# EAGLE board KMO_IO_MV2_2 (EAGLE 9.4.0)
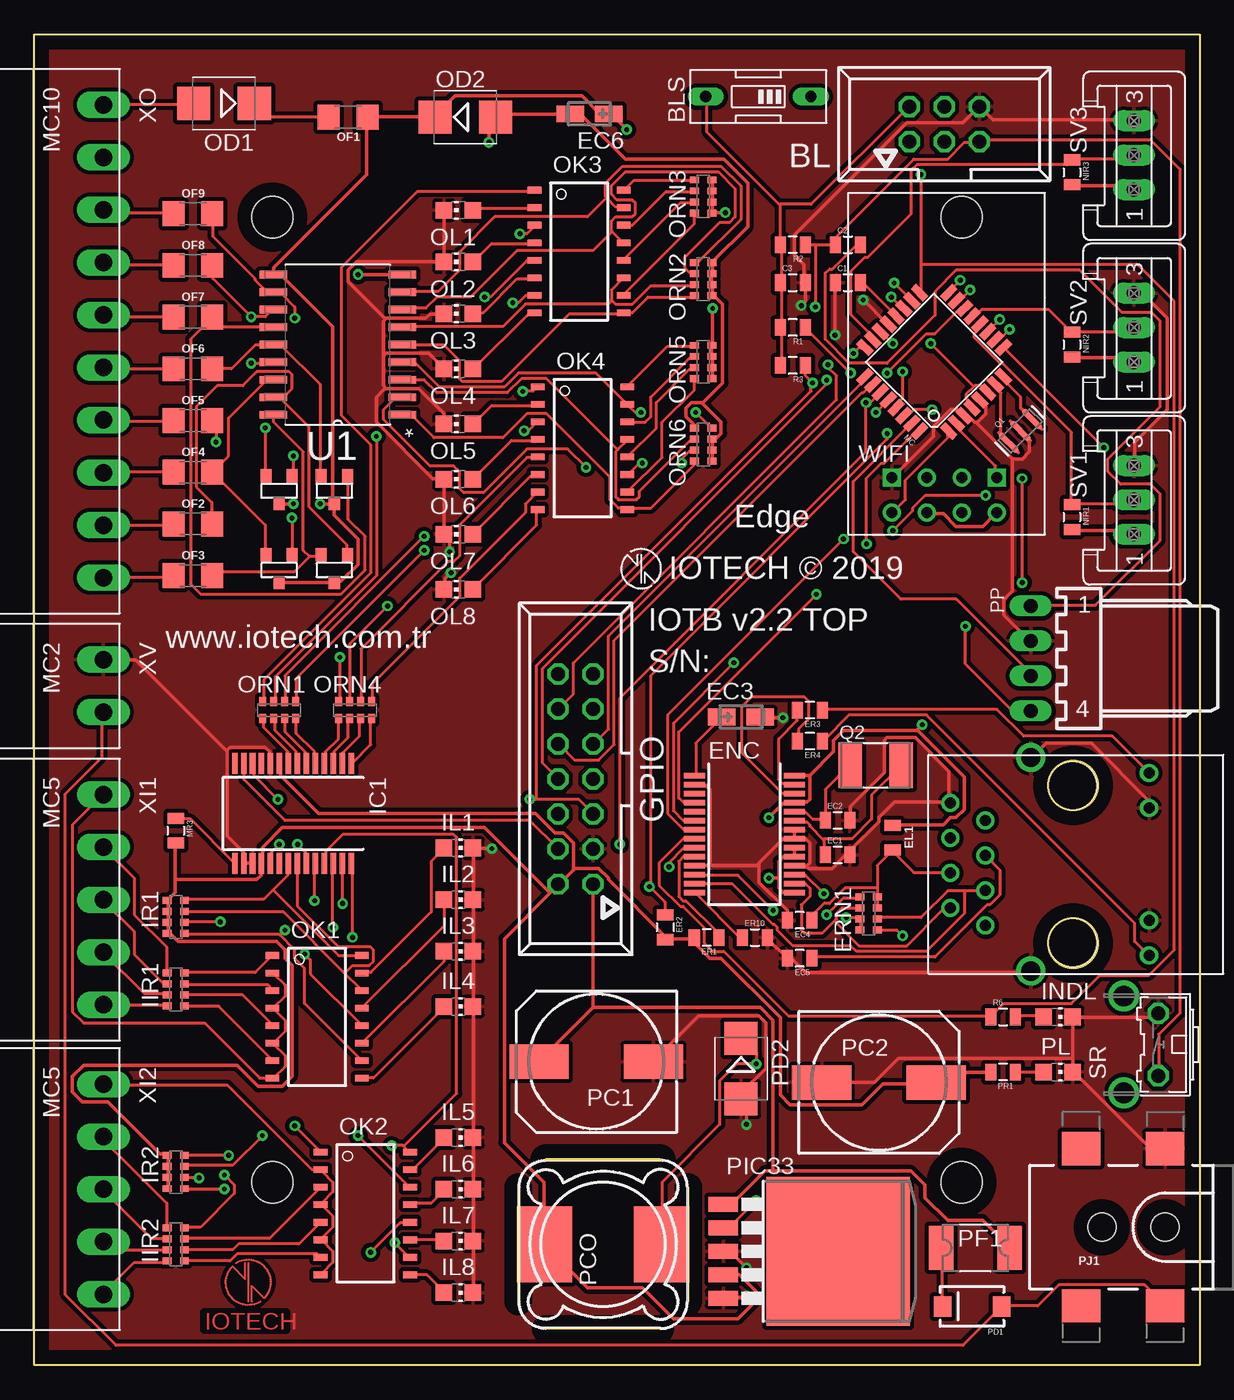
[diagram p2: board, top side]
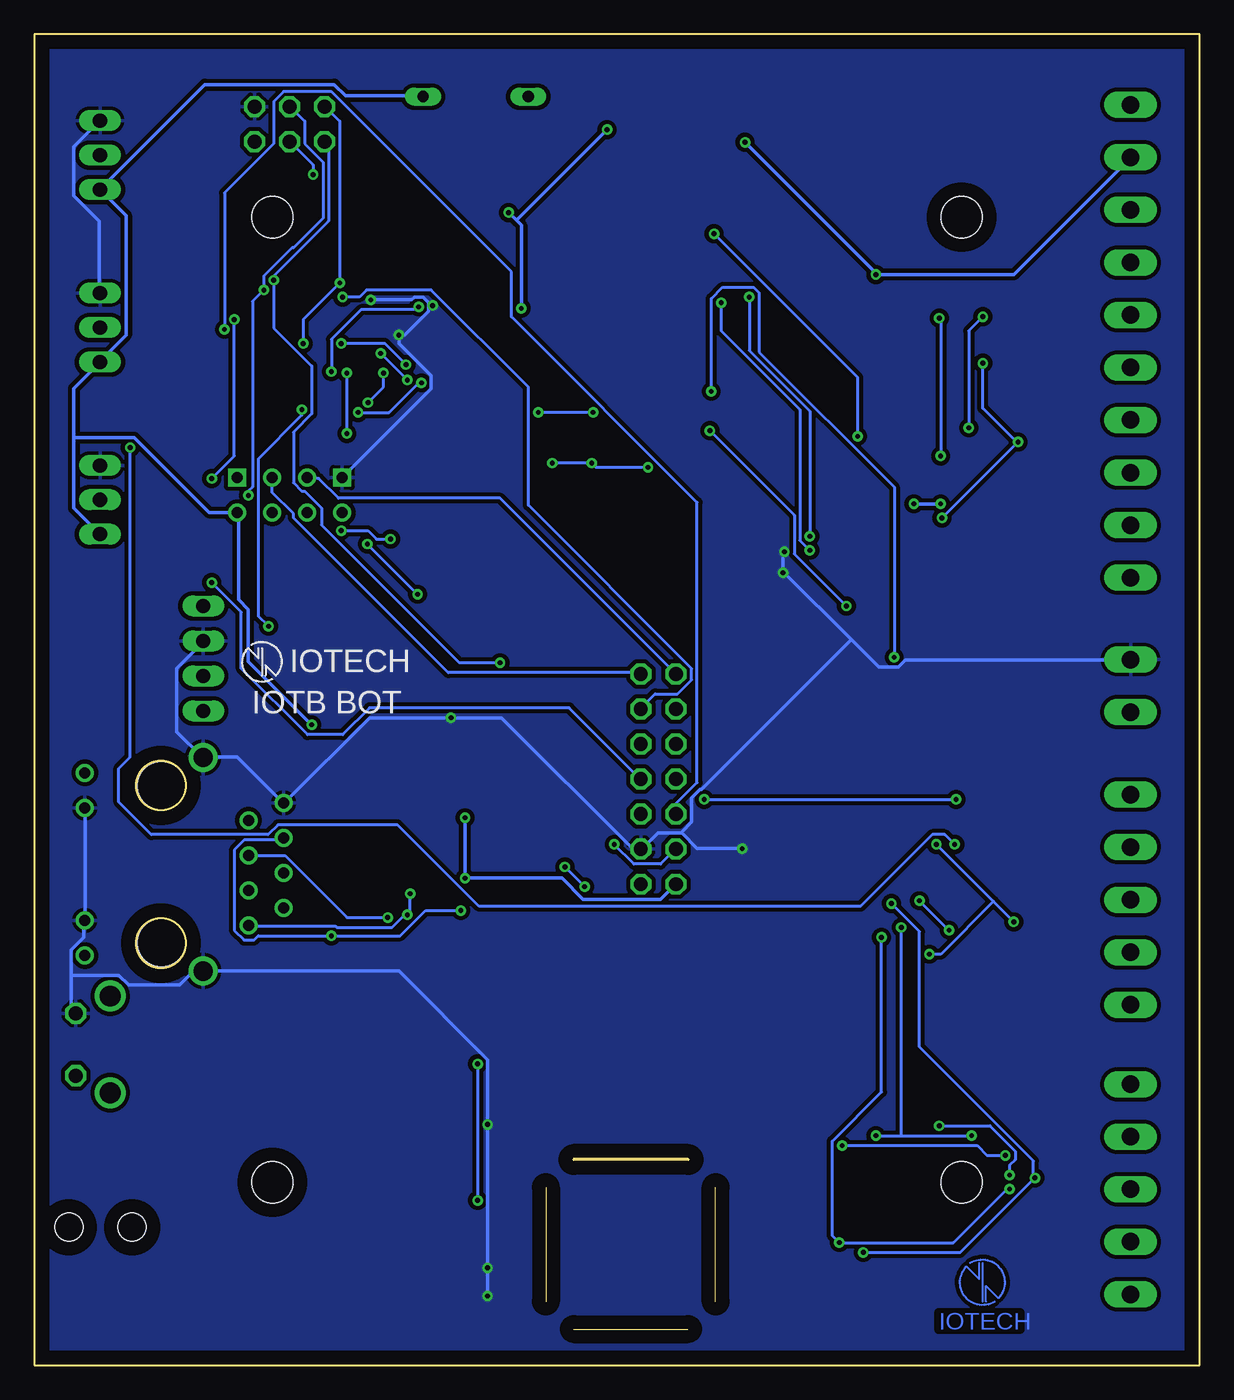
[diagram p3: board, bottom side, seen from below]

Size 84.5 x 96.5 mm. Coordinates in mm from the lower left corner, seen from the top.
Outline: 0,0 0,96.5 84.5,96.5 84.5,0 0,0
Copper layers (1*16): Top 0.035mm / dielectric 1.5mm / Bottom 0.035mm
Design rules "KMO_IO_M": minimum track width 6mil, minimum drill 0.35mm, track to track 0.205mm, track to pad 0.205mm, pad to pad 0.205mm, via to via 0.205mm, smd to smd 6mil, copper to edge 40mil, drill to drill 6mil, minimum pad ring 10mil, minimum via ring 8mil, stop-mask expansion 4mil, vias tented up to drill 0mil, thermal gap 10mil
Net classes: 0 default: width 0.203 mm, drill 0.3 mm, clearance 0.16 mm; 1 vcc: width 0.254 mm, drill 0.3 mm, clearance 0.16 mm; 2 3.3 power line: width 0.254 mm, drill 0.3 mm, clearance 0.16 mm; 3 outsise power line: width 0.254 mm, drill 0.3 mm, clearance 0.16 mm
Holes 3 mm at 17.25,83.25 67.25,83.25 17.25,13.25 67.25,13.25

## Footprints (pad centres in the part's own frame; a part is rotated, then mirrored left to right if it is on the bottom)
057-006-1 = drill 1 octagon: 1 -2.54,-1.27; 2 -2.54,1.27; 3 0,-1.27; 4 0,1.27; 5 2.54,-1.27; 6 2.54,1.27
EDG-01 = drill 0.813 long: 1 0,-3.81; 2 0,3.81
0805 = smd 0.8 x 1.2: 1 -0.9,0; 2 0.9,0
SOT-23-3 = smd 0.802 x 0.972: 1 -0.95,-1; 2 0.95,-1; 3 0,1
CT3216 = smd 2 x 1.2: + -1.4,0; - 1.4,0
SSOP28 = smd 0.4 x 1.5: 1 -4.225,-3.625; 2 -3.575,-3.625; 3 -2.925,-3.625; 4 -2.275,-3.625; 5 -1.625,-3.625; 6 -0.975,-3.625; 7 -0.325,-3.625; 8 0.325,-3.625; 9 0.975,-3.625; 10 1.625,-3.625; 11 2.275,-3.625; 12 2.925,-3.625; 13 3.575,-3.625; 14 4.225,-3.625; 15 4.225,3.625; 16 3.575,3.625; 17 2.925,3.625; 18 2.275,3.625; 19 1.625,3.625; 20 0.975,3.625; 21 0.325,3.625; 22 -0.325,3.625; 23 -0.975,3.625; 24 -1.625,3.625; 25 -2.275,3.625; 26 -2.925,3.625; 27 -3.575,3.625; 28 -4.225,3.625
0603-ARV = smd 0.5 x 0.65: 1 -1.2,-0.625; 2 -0.4,-0.625; 3 0.4,-0.625; 4 1.2,-0.625; 5 1.2,0.625; 6 0.4,0.625; 7 -0.4,0.625; 8 -1.2,0.625
057-014-1 = drill 1 octagon: 1 -7.62,-1.27; 2 -7.62,1.27; 3 -5.08,-1.27; 4 -5.08,1.27; 5 -2.54,-1.27; 6 -2.54,1.27; 7 0,-1.27; 8 0,1.27; 9 2.54,-1.27; 10 2.54,1.27; 11 5.08,-1.27; 12 5.08,1.27; 13 7.62,-1.27; 14 7.62,1.27
CHIP-LED0805 = smd 1.2 x 1.2: A 0,-1.05; C 0,1.05
TQFP32-08 = smd 1.27 x 0.559: 1 -4.293,2.8; 2 -4.293,2; 3 -4.293,1.2; 4 -4.293,0.4; 5 -4.293,-0.4; 6 -4.293,-1.2; 7 -4.293,-2; 8 -4.293,-2.8; 17 4.293,-2.8; 18 4.293,-2; 19 4.293,-1.2; 20 4.293,-0.4; 21 4.293,0.4; 22 4.293,1.2; 23 4.293,2; 24 4.293,2.8 | smd 0.559 x 1.27: 9 -2.8,-4.293; 10 -2,-4.293; 11 -1.2,-4.293; 12 -0.4,-4.293; 13 0.4,-4.293; 14 1.2,-4.293; 15 2,-4.293; 16 2.8,-4.293; 25 2.8,4.293; 26 2,4.293; 27 1.2,4.293; 28 0.4,4.293; 29 -0.4,4.293; 30 -1.2,4.293; 31 -2,4.293; 32 -2.8,4.293
SMB = smd 2.4 x 2.4: A 2.2,0; C -2.2,0
1206 = smd 1.6 x 1.8: 1 -1.4,0; 2 1.4,0
MINI-FLAT-16 = smd 1 x 0.5: 1 -3.24,4.445; 2 -3.24,3.175; 3 -3.24,1.905; 4 -3.24,0.635; 5 -3.24,-0.635; 6 -3.24,-1.905; 7 -3.24,-3.175; 8 -3.24,-4.445; 9 3.24,-4.445; 10 3.24,-3.175; 11 3.24,-1.905; 12 3.24,-0.635; 13 3.24,0.635; 14 3.24,1.905; 15 3.24,3.175; 16 3.24,4.445
140CLH-1010 = smd 4.3 x 2.5: + 4.15,0; - -4.15,0
MSS1260 = smd 5.5 x 4: P$1 0,4.25; P$2 0,-4.25
SMA-DIODE = smd 1.27 x 1.47: A -2.15,0; C 2.15,0
1820 = smd 1.78 x 3.2: 1 -2.49,0; 2 2.49,0
TO263-5 = smd 1.067 x 2.159: 1 -3.404,-5.791; 2 -1.702,-5.791; 3 0,-5.791; 4 1.702,-5.791; 5 3.404,-5.791 | smd 10.8 x 10.41: 6 0,2.54
POWER_JACK_SMD_OVERPASTE_TOE = smd 2.8 x 2.4: GND 0,-5.7; P$4 6.1,-5.7; VIN0 0,5.7; VIN1 6.1,5.7 | hole 2.032: 0,0; 4.572,0
7395-04 = drill 1.016 long: 1 3.81,0; 2 1.27,0; 3 -1.27,0; 4 -3.81,0
RESONATOR-SMD-1:1 = smd 0.45 x 1.905: 1 -1.2,0; 2 0,0; 3 1.2,0
5.0X3.2_2 = smd 1.7 x 3.3: 1 -1.85,0; 2 1.85,0
B3F-31XX = drill 1.016 octagon: 1 -2.261,-1.245; 2 2.261,-1.245 | drill 1.499 pad 2.159: 3 -3.505,1.245; 4 3.505,1.245
S03P = drill 1.016 long: 1 2.5,0; 2 0,0; 3 -2.5,0
SOIC127P1030X265-18N = smd 1.981 x 0.559: 1 -4.674,5.08; 2 -4.674,3.81; 3 -4.674,2.54; 4 -4.674,1.27; 5 -4.674,0; 6 -4.674,-1.27; 7 -4.674,-2.54; 8 -4.674,-3.81; 9 -4.674,-5.08; 10 4.674,-5.08; 11 4.674,-3.81; 12 4.674,-2.54; 13 4.674,-1.27; 14 4.674,0; 15 4.674,1.27; 16 4.674,2.54; 17 4.674,3.81; 18 4.674,5.08
RJ45 = drill 0.8: G+ 5.84,-6.305; G- 5.84,-3.765; GND -8.57,4.76; NC -6.03,3.5; P4 -8.57,-0.32; P5 -6.03,0.96; RD+ -6.03,-1.58; RD- -8.57,2.22; TD+ -6.03,-4.12; TD- -8.57,-2.86; Y+ 5.84,6.945; Y- 5.84,4.405 | drill 1.4: SHIELD1 -2.73,-7.425; SHIELD2 -2.73,8.065 | hole 3.5: 0.3,-5.38; 0.3,6.02
ESP01 = drill 0.8: CH_PD -1.285,-8.178; GPIO0 1.255,-5.638; GPIO2 -1.285,-5.638; RST 1.255,-8.178; TX -3.825,-8.178; VCC 3.795,-8.178 | drill 0.8 square: GND -3.825,-5.638; RX 3.795,-5.638
MC5 = drill 1.27 long: 1 -7.62,0; 2 -3.81,0; 3 0,0; 4 3.81,0; 5 7.62,0
MC10 = drill 1.27 long: 1 -17.145,0; 2 -13.335,0; 3 -9.525,0; 4 -5.715,0; 5 -1.905,0; 6 1.905,0; 7 5.715,0; 8 9.525,0; 9 13.335,0; 10 17.145,0
MC2 = drill 1.27 long: 1 -1.905,0; 2 1.905,0

## Placement (x,y rotation side)
BL  057-006-1  [057-006-1]  66,90 0 top
BLS  on-off  [EDG-01]  52.5,92 90 top
C1  100nF  [0805]  59,78.5 0 top
C2  100nF  [0805]  59,81.25 0 top
C3  100nF  [0805]  55,78.5 0 top
D1  BAV70  [SOT-23-3]  21.75,57.75 180 top
D2  BAV70  [SOT-23-3]  17.75,57.75 180 top
D3  BAV70  [SOT-23-3]  21.75,63.5 180 top
D4  BAV70  [SOT-23-3]  17.75,63.5 180 top
EC1  18p  [0805]  58.25,37 0 top
EC2  18p  [0805]  58.25,39.5 0 top
EC3  10u  [CT3216]  51.25,47 0 top
EC4  10n  [0805]  55.5,32.25 180 top
EC5  10n  [0805]  55.5,29.5 180 top
EC6  10u  [CT3216]  40.25,90.75 180 top
EL1  10µH  [0805]  62.25,38.25 270 top
ENC  ENC28J60-SSOP  [SSOP28]  51.5,38.5 270 top
ER1  10k  [0805]  48.75,31 180 top
ER2  10k  [0805]  45.75,31.75 270 top
ER3  1k  [0805]  56.25,47.5 180 top
ER4  1k  [0805]  56.25,45.25 180 top
ER10  2.7K  [0805]  52.25,31 0 top
ERN1  49.9R  [0603-ARV]  60.5,32.75 270 top
GPIO  057-014-1  [057-014-1]  39.25,42.5 90 top
IC1  MCP23017SS  [SSOP28]  18.75,40 180 top
IIR1  6.8K  [0603-ARV]  10.25,27.25 270 top
IIR2  6.8K  [0603-ARV]  10.25,8.75 270 top
IL1  BLU  [CHIP-LED0805]  30.75,37.5 270 top
IL2  BLU  [CHIP-LED0805]  30.75,33.75 270 top
IL3  BLU  [CHIP-LED0805]  30.75,30 270 top
IL4  BLU  [CHIP-LED0805]  30.75,26 270 top
IL5  BLU  [CHIP-LED0805]  30.75,16.5 270 top
IL6  BLU  [CHIP-LED0805]  30.75,12.75 270 top
IL7  BLU  [CHIP-LED0805]  30.75,9 270 top
IL8  BLU  [CHIP-LED0805]  30.75,5.25 270 top
INDL  BLU  [CHIP-LED0805]  74.25,25.25 270 top
IR1  1K  [0603-ARV]  10.25,32.5 270 top
IR2  1K  [0603-ARV]  10.25,14 270 top
MC  ATMEGA328  [TQFP32-08]  65.25,72.75 135 top
MR3  10K  [0805]  10.25,38.75 270 top
NIR1  4700  [0805]  75.25,61.5 270 top
NIR2  4700  [0805]  75.25,74 270 top
NIR3  4700  [0805]  75.25,86.5 270 top
OD1  SS54  [SMB]  13.75,91.5 180 top
OD2  28V  [SMB]  31.25,90.5 0 top
OF1  750mA  [1206]  22.75,90.5 180 top
OF2  100mA  [1206]  11.5,61 0 top
OF3  100mA  [1206]  11.5,57.25 0 top
OF4  100mA  [1206]  11.5,64.75 0 top
OF5  100mA  [1206]  11.5,68.5 0 top
OF6  100mA  [1206]  11.5,72.25 0 top
OF7  100mA  [1206]  11.5,76 0 top
OF8  100mA  [1206]  11.5,79.75 0 top
OF9  100mA  [1206]  11.5,83.5 0 top
OK1  TLP283-4  [MINI-FLAT-16]  20.5,25.25 0 top
OK2  TLP283-4  [MINI-FLAT-16]  24,11 0 top
OK3  TLP283-4  [MINI-FLAT-16]  39.5,80.75 0 top
OK4  TLP283-4  [MINI-FLAT-16]  39.75,66.5 0 top
OL1  BLU  [CHIP-LED0805]  30.75,83.75 90 top
OL2  BLU  [CHIP-LED0805]  30.75,80 90 top
OL3  BLU  [CHIP-LED0805]  30.75,76.25 90 top
OL4  BLU  [CHIP-LED0805]  30.75,72.25 90 top
OL5  BLU  [CHIP-LED0805]  30.75,68.25 90 top
OL6  BLU  [CHIP-LED0805]  30.75,64.25 90 top
OL7  BLU  [CHIP-LED0805]  30.75,60.25 90 top
OL8  BLU  [CHIP-LED0805]  30.75,56.25 90 top
ORN1  1K  [0603-ARV]  17.75,47.5 180 top
ORN2  10K  [0603-ARV]  48.5,78.75 270 top
ORN3  10K  [0603-ARV]  48.5,84.75 270 top
ORN4  1K  [0603-ARV]  23.25,47.5 180 top
ORN5  10K  [0603-ARV]  48.5,72.75 270 top
ORN6  10K  [0603-ARV]  48.5,66.75 270 top
PC1  220uf 50v  [140CLH-1010]  40.75,22 180 top
PC2  220uf 50v  [140CLH-1010]  61.25,20.5 0 top
PCO  220 uh  [MSS1260]  41.25,8.75 90 top
PD1  M7  [SMA-DIODE]  68,4.25 180 top
PD2  SS54  [SMB]  51.25,21.5 270 top
PF1  1A  [1820]  68.25,8.5 0 top
PIC33  LM2596S  [TO263-5]  55.75,8.25 270 top
PJ1  POWER_JACKTOE  [POWER_JACK_SMD_OVERPASTE_TOE]  82,10 180 top
PL  GRN  [CHIP-LED0805]  74.25,21.25 270 top
PP  22-05-7048-04  [7395-04]  72.25,51.25 90 top
PR1  1k  [0805]  70.25,21.25 180 top
Q1  8MHz  [RESONATOR-SMD-1:1]  71.5,67.75 45 top
Q2  25MHz  [5.0X3.2_2]  61,43.5 0 top
R1  1.5K  [0805]  55,75.25 180 top
R2  10K  [0805]  55,81.25 180 top
R3  1.5K  [0805]  55,72.5 180 top
R6  1k  [0805]  70.25,25.25 0 top
SR  gnd  [B3F-31XX]  80.25,23.25 90 top
SV1  3.3V  [S03P]  79.75,62.75 270 top
SV2  3.3V  [S03P]  79.75,75.25 270 top
SV3  3.3V  [S03P]  79.75,87.75 270 top
U1  ULN2803ADW  [SOIC127P1030X265-18N]  22,74 180 top
U$1  [IOTECH_COPPER_W_TEXT]  15.5,6 0 top
U$2  HR911105A  [RJ45]  75,36 0 top
U$4  [IOTECH_COPPER_W_TEXT]  15.75,6 0 bottom
WIFI  ESP01  [ESP01]  66,70 0 top
XI1  MC5  [MC5]  5,33.75 270 top
XI2  MC5  [MC5]  5,12.75 270 top
XO  MC10  [MC10]  5,74.25 270 top
XV  MC2  [MC2]  5,49.25 270 top

## Tracks (layer width: path | path; a pad name or v marks a point on that pad's centre or on a via)
+3V3  (via drill 0.35)
  Top 0.254: WIFI.CH_PD 64.8,61.74 65.92,61.74 66.84,60.82 68.78,60.82 69.7,61.74 WIFI.VCC | NIR1.2 75.31,60.52 79.5,60.52 79.7,60.31 SV1.1 | NIR2.2 75.31,73.07 79.39,73.07 79.7,72.76 SV2.1 | NIR3.2 75.31,85.52 79.5,85.52 79.7,85.31 SV3.1 | IR2.4 9.7,12.86 9.7,13.57 IR2.3 9.7,13.68 9.7,14.29 IR2.2 9.7,14.49 9.7,15.1 IR2.1 9.59,15.31 9.08,15.31 5.31,19.08 3.47,19.08 2.75,19.8 2.75,20.92 3.57,21.74 14.7,21.74 16.23,20.21 17.96,20.21 18.68,20.92 18.68,28.98 18.16,29.49 18.16,30.11 17.55,30.72 10.41,30.72 9.8,31.33 IR1.4 9.7,31.33 9.7,32.04 IR1.3 9.7,32.15 9.7,32.86 IR1.2 9.7,32.96 9.7,33.68 IR1.1 9.7,33.78 10.21,34.29 10.21,35.21 | 10.21,35.21 10.21,37.76 MR3.2 | 10.21,35.21 16.12,35.21 16.43,35.51 16.43,36.33 IC1.18 16.53,36.43 16.53,37.55 17.96,38.98 32.66,38.98 37.4,34.24 | PIC33.4 50.01,6.53 51.13,6.53 52.35,5.31 52.35,4.69 51.02,3.37 46.33,3.37 44.09,5.61 40.11,5.61 37.04,8.67 PCO.P$1 36.94,8.78 36.94,13.27 34.09,16.12 34.09,30.92 37.4,34.24 | 64.09,46.02 67.45,42.66 67.45,40.31 66.84,39.7 66.44,39.7 65.92,39.19 62.25,39.19 EL1.1 | 64.09,46.02 58.68,46.02 57.96,45.31 57.96,44.49 56.23,42.76 | 56.23,42.76 55.21,42.76 ENC.28 | 56.23,42.76 56.23,41.02 56.02,40.82 55.21,40.82 ENC.25 55.11,40.72 54.29,40.72 v53.27,39.7 | PR1.2 69.29,21.23 66.13,21.23 65.41,20.51 PC2.+ 65.31,20.41 61.54,20.41 60.01,18.88 54.8,18.88 54.09,19.59 54.09,25.21 49.8,29.49 48.98,29.49 47.66,30.82 ER1.2 47.76,30.92 45.82,30.92 ER2.2 45.82,31.02 41.64,35.21 41.64,35.31 40.92,36.02 39.09,36.02 | 53.98,35.31 53.98,36.53 54.29,36.84 55.11,36.84 ENC.19 55.11,36.94 55.11,37.45 ENC.20
  Top 0.254: 53.98,35.31 53.98,34.59 54.29,34.29 55.11,34.29 ENC.15 | 39.09,36.02 39.09,35.92 38.06,34.9 GPIO.2 37.96,34.8 37.4,34.24 | 39.09,36.02 39.09,37.86 38.37,38.58 37.76,38.58 36.33,40 20.61,40 17.86,42.76 17.86,43.58 IC1.9 | v53.27,35.31 53.98,35.31 | v64.39,46.43 64.09,46.13 64.09,46.02
  Bottom 0.254: 81.64,67.25 81.64,70.82 79.8,72.66 SV2.1 79.7,72.86 77.86,74.7 77.86,83.38 79.7,85.21 SV3.1 79.7,85.31 72.15,92.86 62.76,92.86 61.94,92.05 56.33,92.05 BLS.1 | 81.64,67.25 81.64,62.15 79.8,60.31 SV1.1 | 81.64,67.25 77.25,67.25 71.84,61.84 69.8,61.84 WIFI.VCC 69.7,61.74 69.7,55.52 68.99,54.8 68.99,51.02 v64.39,46.43 | GPIO.2 38.06,34.8 39.09,33.78 44.7,33.78 46.23,35.31 v53.27,35.31 v53.27,39.7
A0
  Top 0.203: SV3.2 79.7,87.66 79.5,87.46 75.31,87.46 NIR3.1 75.21,87.36 74.91,87.05 63.98,87.05 63.58,86.64 63.58,83.48 60.41,80.31 60.21,80.31 59.19,79.29 59.19,76.23 60.72,74.7 60.72,74.39 MC.23
A1  (via drill 0.35)
  Top 0.203: v59.39,73.37 59.8,73.78 60.21,73.78 MC.24 | v57.45,71.44 57.45,71.13 36.84,50.52 36.84,43.68 37.96,42.55 GPIO.8
  Bottom 0.203: v57.45,71.44 v59.39,73.37
A2
  Top 0.203: MC.25 60.21,71.64 60.21,71.44 41.64,52.86 41.64,46.13 40.62,45.11 GPIO.9
A3
  Top 0.203: MC.26 60.72,71.13 60.11,70.52 60.01,70.52 42.05,52.56 42.05,45 40.92,43.88 39.19,43.88 38.06,45 GPIO.10
A4  (via drill 0.35)
  Top 0.203: v59.19,71.94 55.92,75.21 R1.1 | MC.27 61.33,70.52 60.62,69.8 v60.31,69.8 60.31,66.23 42.45,48.37 v42.45,37.76 | IC1.13 15.21,43.58 15.21,42.45 18.16,39.49 35.92,39.49 37.96,37.45 GPIO.4
  Bottom 0.203: v59.19,71.94 59.19,70.92 v60.31,69.8 | v42.45,37.76 41.02,36.33 39.09,36.33 38.06,37.35 GPIO.4
A5  (via drill 0.35)
  Top 0.203: v61.03,69.09 61.84,69.9 MC.28 | R3.1 55.92,72.46 55.92,71.74 v56.43,71.23 56.33,71.23 56.33,70.62 36.43,50.72 36.43,41.02 | v17.66,41.02 15.92,42.76 15.92,43.58 IC1.12 | 36.43,41.02 39.49,41.02 40.51,40 GPIO.5 | 36.43,41.02 v35.92,41.02
  Bottom 0.203: v56.43,71.23 56.64,71.23 58.78,69.09 v61.03,69.09 | v35.92,41.02 v17.66,41.02
A6  (via drill 0.35)
  Top 0.203: v62.15,77.46 62.97,76.64 MC.19
  Bottom 0.203: v62.15,77.46 60.92,77.46 60.41,77.97 55.72,77.97 48.68,70.92 48.68,62.35 36.84,50.52 36.84,49.7 37.86,48.68 39.49,48.68 40.51,47.66 GPIO.11
A7  (via drill 0.35)
  Top 0.203: v62.25,74.09 61.43,74.91 MC.22 | v57.56,72.56 57.56,72.35 58.17,71.74 58.17,70.01 39.09,50.92 39.09,48.68 38.06,47.66 GPIO.12
  Bottom 0.203: v62.25,74.09 59.09,74.09 v57.56,72.56
AREF
  Top 0.203: C1.2 59.9,78.48 60.11,78.48 62.45,76.13 MC.20
BLV  (via drill 0.35)
  Top 0.203: R3.2 54.19,72.56 54.19,75.21 R1.2 54.19,75.31 54.19,78.48 C3.1 54.19,78.58 54.19,81.23 R2.2 54.09,81.33 54.09,84.09 54.03,84.14 | 54.03,84.14 48.78,89.4 48.78,91.95 BLS.2 | 68.12,70.98 68.17,71.03 68.68,71.03 69.09,70.62 MC.6 | 68.12,70.98 67.56,70.42 67.56,70.11 67.97,69.7 67.97,69.5 MC.4 | v62.35,78.48 63.58,77.25 MC.18 | v65.01,74.09 68.12,70.98 | 54.03,84.14 54.09,84.19 56.33,84.19 63.37,91.23 BL.2
  Bottom 0.203: BL.2 63.37,91.23 62.35,90.21 v62.35,78.48 65.01,75.82 v65.01,74.09
COM1
  Top 0.203: OK1.2 17.35,28.37 18.16,27.55 18.16,26.74 17.35,25.92 OK1.4 17.35,25.82 18.16,25 18.16,24.19 17.35,23.37 OK1.6 17.35,23.27 18.16,22.45 18.16,21.64 17.35,20.82 OK1.8 17.25,20.82 16.33,20.82 12.35,24.8 3.57,24.8 2.75,25.61 2.75,39.19 4.9,41.33 XI1.1
COM2
  Top 0.203: OK2.8 20.82,6.63 21.64,7.45 21.64,8.27 20.82,9.08 OK2.6 20.82,9.18 21.64,10 21.64,10.82 20.82,11.63 OK2.4 20.82,11.74 21.64,12.55 21.64,13.27 20.82,14.08 OK2.2 20.72,14.19 20.1,14.19 13.98,20.31 5,20.31 XI2.1
D2  (via drill 0.35)
  Top 0.203: v60.36,59.54 60.36,64.34 61.43,65.41 61.64,65.41 63.88,67.66 64.19,67.66 MC.32 | v56.71,55.9 46.74,45.92 46.74,41.13 47.05,40.82 47.86,40.82 ENC.4
  Bottom 0.203: v56.71,55.9 v60.36,59.54
D3
  Top 0.203: MC.1 66.23,67.66 66.23,67.25 63.17,64.19 63.17,62.76 62.25,61.84 WIFI.TX
D4
  Top 0.203: MC.2 66.94,68.27 66.94,67.97 69.7,65.21 69.7,64.39 WIFI.RX
D5  (via drill 0.35)
  Top 0.203: v77.56,66.54 70.31,73.78 MC.9 | v17.76,37.76 17.14,37.15 17.14,36.43 IC1.19
  Bottom 0.203: v77.56,66.54 77.56,44.09 78.37,43.27 78.37,40.82 76.03,38.47 67.56,38.47 66.84,39.19 58.17,39.19 52.25,33.27 24.59,33.27 19.39,38.47 18.47,38.47 v17.76,37.76
D6  (via drill 0.35)
  Top 0.203: v70.72,75.11 70.01,74.39 69.7,74.39 MC.10
  Bottom 0.203: v70.72,75.11 70.72,85.01 67.15,88.58 67.15,91.64 66.44,92.36 62.97,92.36 49.9,79.29 49.9,76.03 36.43,62.56 36.43,42.25 37.96,40.72 37.96,40 GPIO.6
D7  (via drill 0.35)
  Top 0.203: v70.01,75.82 69.19,75.01 MC.11 | v71.64,56.74 v71.64,64.29
  Bottom 0.203: v70.01,75.82 70.01,65.92 v71.64,64.29 | v71.64,56.74 69.5,54.6 69.5,50.52 64.7,45.72 62.15,45.72 60.21,47.66 45.72,47.66 40.62,42.55 GPIO.7
D8
  Top 0.203: SV1.2 79.7,62.66 79.5,62.45 75.31,62.45 NIR1.1 75.21,62.45 75.21,67.66 70.21,72.66 70.01,72.66 68.17,74.5 68.17,74.8 68.48,75.11 68.48,75.42 MC.12
D9
  Top 0.203: SV2.2 79.7,75.21 79.39,74.91 75.31,74.91 NIR2.1 75.21,74.91 73.58,76.54 68.68,76.54 68.27,76.13 68.07,76.13 MC.13
D10  (via drill 0.35)
  Top 0.203: v46.02,36.13 46.02,36.43 47.05,37.45 47.86,37.45 ENC.9 | ER2.1 45.72,32.66 45.72,33.57 v44.6,34.7 44.7,34.7 44.7,50.01 61.84,67.15 v61.84,67.56 | v61.84,71.94 64.7,74.8 65.31,74.8 67.05,76.54 67.35,76.54 MC.14
  Bottom 0.203: v46.02,36.13 v44.6,34.7 | v61.84,67.56 v61.84,71.94
D11  (via drill 0.35)
  Top 0.203: v67.86,77.97 67.15,77.25 66.94,77.25 MC.15 | v58.68,59.9 45.92,47.15 45.92,40 47.05,38.88 47.86,38.88 ENC.7 | v62.25,60.52 63.68,61.94 63.68,62.15 64.6,63.07 v68.99,63.07
  Bottom 0.203: BL.4 65.92,91.23 64.9,90.21 64.9,88.58 63.58,87.25 63.58,83.17 65.72,81.03 65.82,81.03 67.86,78.99 v67.86,77.97 68.68,77.15 68.68,63.68 68.99,63.37 v68.99,63.07 | v58.68,59.9 59.7,59.9 60.31,60.52 v62.25,60.52
D12  (via drill 0.35)
  Top 0.203: v67.15,78.68 66.33,77.86 MC.16 | v50.73,50.93 46.33,46.53 46.33,40.21 47.05,39.49 47.86,39.49 ENC.6
  Bottom 0.203: BL.1 63.37,88.68 63.17,88.48 63.17,82.97 67.15,78.99 v67.15,78.68 67.15,75.21 64.39,72.46 64.39,68.99 65.72,67.66 65.72,63.98 65.11,63.37 64.9,63.37 63.68,62.15 63.68,60.92 53.69,50.93 v50.73,50.93
D13  (via drill 0.35)
  Top 0.203: v64.29,86.33 64.29,79.8 | 64.29,79.8 64.29,77.86 MC.17 | ENC.8 47.86,38.17 47.05,38.17 45.31,36.43 45.31,34.8 46.84,33.27 47.05,33.27 48.58,31.74 48.58,30.61 49.19,30 50.01,30 54.7,25.31 69.29,25.31 R6.1 69.39,25.31 70.31,26.23 75.21,26.23 77.25,28.27 80.82,28.27 82.66,30.11 82.66,77.15 80.01,79.8 64.29,79.8
  Bottom 0.203: v64.29,86.33 64.29,87.05 65.92,88.68 BL.3
DTR
  Top 0.203: C2.2 59.8,81.23 59.6,81.23 57.86,79.5 57.66,79.5 57.35,79.19 57.35,74.39 59.09,72.66 61.84,72.66 65.31,76.13 65.31,77.86 66.84,79.39 75.82,79.39 78.89,76.33 81.03,76.33 81.64,75.72 81.64,69.5 77.86,65.72 77.86,64.8 78.78,63.88 80.93,63.88 81.64,63.17 81.64,59.8 76.95,55.11 72.25,55.11 PP.1
EP4
  Top 0.203: ERN1.7 61.13,33.17 61.13,33.88 ERN1.8 61.13,33.98 61.13,34.59 | 61.13,34.59 61.13,36.23 62.15,37.25 EL1.2 62.25,37.25 63.78,35.72 66.33,35.72 U$2.P4 | 61.13,34.59 58.78,34.59 57.66,33.47 57.25,33.47 56.43,32.66 56.43,32.35 EC4.1
EP5  (via drill 0.35)
  Top 0.203: ERN1.4 59.9,31.64 59.9,32.35 ERN1.3 59.8,32.45 v58.88,32.45 | EC5.1 56.43,29.59 65.31,29.59 69.09,33.37 69.29,33.37 70.01,34.09 70.01,35.92 68.99,36.94 U$2.P5
  Bottom 0.203: v58.88,32.45 61.84,32.45 66.33,36.94 68.88,36.94 U$2.P5
GND  (via drill 0.35)
  Top 0.254: v51.64,5 51.53,4.9 50.01,4.9 PIC33.5 | v51.64,7.04 50.52,8.16 50.01,8.16 PIC33.3 | PC1.- 44.9,22.04 48.17,25.31 52.56,25.31 53.07,24.8 53.07,21.53 51.33,19.8 51.33,19.39 PD2.A 51.23,19.18 51.64,18.78 v51.64,17.45 | ER10.2 53.17,30.92 EC5.2 54.7,29.49 54.9,29.49 55.92,28.47 72.15,28.47 72.25,28.57 U$2.SHIELD1 | 75.31,22.25 75.31,25.21 INDL.C 75.42,25.21 81.23,25.21 81.44,25.41 SR.2 | 75.31,22.25 75.31,21.33 PL.C 75.42,21.23 80.93,15.72 81.95,15.72 PJ1.GND | 75.31,22.25 62.66,22.25 60.92,20.51 57.15,20.51 PC2.- | IC1.17 15.82,36.43 15.21,36.43 IC1.16 15.21,36.53 15.21,37.15 13.98,38.37 13.98,44.6 | 13.98,44.6 14.19,44.8 16.74,44.8 17.04,44.49 17.04,43.68 IC1.10 | XV.1 5,51.13 7.35,51.13 13.88,44.6 13.98,44.6 | v30.21,57.45 29.8,57.05 29.8,56.33 OL8.C | v30.11,58.98 30.11,59.9 29.8,60.21 OL7.C 29.7,60.31 29.7,64.19 OL6.C 29.59,64.29 28.88,64.29 24.8,68.37 24.8,70.21 25.41,70.82 25.51,70.82 | OL1.C 29.7,83.68 OL2.C 29.59,80.01 23.37,80.01 22.76,79.39 22.76,78.58 25.41,75.92 25.51,75.92 | 25.51,70.82 27.86,70.82 29.7,68.99 29.7,68.27 OL5.C | 25.51,70.82 25.31,71.03 25.31,73.17 | 25.31,73.17 25.51,73.37 28.57,73.37 OL4.C | 25.51,75.92 28.37,75.92 28.68,76.23 29.7,76.23 OL3.C | 25.51,75.92 25.31,75.72 25.31,73.17 | SV1.3 79.8,65.31 79.8,66.94 82.15,69.29 82.15,75.92 80.42,77.66 79.8,77.66 SV2.3 | SV3.3 79.7,90.31 69.5,90.31 68.58,91.23 BL.6 68.48,91.23 67.35,90.11 63.27,90.11 55.11,81.95 55.11,80.52 55.82,79.8 55.82,78.58 C3.2 55.92,78.37 55.92,77.15 v55.62,76.84 | IL8.C 31.84,5.31 31.84,8.98 IL7.C 31.84,9.08 31.84,12.65 IL6.C 31.84,12.86 31.84,16.43 IL5.C 31.84,16.53 31.84,25.92 IL4.C 31.84,26.02 31.84,29.9 IL3.C 31.84,30.11 31.84,33.68 IL2.C 31.84,33.78 31.84,37.45 IL1.C 31.94,37.45 v33.17,37.45
  Top 0.254: 68.37,68.37 68.17,68.37 67.76,68.78 67.45,68.78 MC.3 67.35,68.88 66.94,69.29 66.44,69.29 65.21,68.07 65.21,67.35 62.25,64.39 WIFI.GND | 68.37,68.37 68.99,68.99 68.99,69.5 68.58,69.9 MC.5 | 70.92,65.72 71.64,65.72 72.15,66.23 72.15,66.94 Q1.2 | 70.92,65.72 68.37,68.27 68.37,68.37 | v58.07,74.7 58.07,78.48 C1.1 | v60.11,77.25 61.84,75.52 MC.21 | 56.02,36.13 56.13,36.02 57.86,36.02 58.78,36.94 59.09,36.94 EC1.2 59.19,37.04 59.19,37.35 61.23,39.39 61.23,39.7 62.35,40.82 66.23,40.82 U$2.GND 66.33,40.82 66.33,43.06 63.88,45.51 61.84,45.51 61.64,45.31 61.64,42.96 59.19,40.51 59.19,39.59 EC2.2 | 56.02,36.13 55.21,36.13 ENC.18 | 52.56,36.23 52.56,36.43 54.29,38.17 55.11,38.17 ENC.21 | 52.56,36.23 52.56,35 54.6,32.96 54.6,32.35 EC4.2 | 52.56,36.23 48.98,36.23 | 48.98,36.23 47.96,36.23 ENC.11 | ENC.22 55.11,38.78 55.11,38.27 ENC.21 | 48.98,36.23 48.98,41.74 48.68,42.05 47.96,42.05 ENC.2 | 56.02,36.13 56.02,36.23 56.23,36.43 56.23,37.86 55.92,38.17 55.21,38.17 ENC.21 | v54.29,46.94 52.66,46.94 EC3.- | 70.92,65.72 70.92,56.13 70.31,55.52 70.31,54.39 72.15,52.56 PP.2 | U$2.Y- 80.82,40.41 80.82,40.92 76.64,45.11 73.37,45.11 72.35,44.09 U$2.SHIELD2
  Bottom 0.254: v51.64,5 v51.64,7.04 v51.64,17.45 51.64,22.14 58.07,28.57 72.15,28.57 U$2.SHIELD1 72.35,28.57 72.97,28.57 73.99,27.55 77.66,27.55 78.37,28.27 81.84,28.27 | 81.84,28.27 81.84,25.82 81.54,25.51 SR.2 | 81.84,28.27 81.84,30.11 80.93,31.02 80.93,32.15 U$2.G- 80.82,32.35 80.82,40.31 U$2.Y- | v30.11,58.98 30.21,58.88 v30.21,57.45 30.11,57.45 25.26,52.61 | 25.26,52.61 23.27,50.62 21.84,50.62 21.33,51.13 5,51.13 XV.1 | SV2.3 79.8,77.76 79.8,82.97 81.64,84.8 81.64,88.38 79.8,90.21 SV3.3 | WIFI.GND 62.15,64.39 55.72,70.82 55.72,71.74 58.07,74.09 v58.07,74.7 57.66,74.7 55.92,76.44 55.92,76.84 | v60.11,77.25 57.15,77.25 56.94,77.46 56.33,77.46 55.92,77.05 55.92,76.84 | PP.2 72.25,52.45 74.19,50.52 74.19,45.92 72.35,44.09 U$2.SHIELD2 72.15,44.09 69.8,44.09 66.54,40.82 U$2.GND 66.33,40.82 60.21,46.94 v54.29,46.94 50.62,46.94 41.13,37.45 40.62,37.45 GPIO.3 40.41,37.45 39.29,38.58 37.55,38.58 | v33.17,37.45 36.43,37.45 37.55,38.58 | 55.92,76.84 v55.62,76.84 | 25.26,52.61 36.13,41.74 36.23,41.74 36.84,41.13 36.84,39.39 37.55,38.68 37.55,38.58
  pour Top (isolate 0.305): -2.5,99.5 89.75,99.5 89.75,-3.25 89.5,-3.5 -4.75,-3.5 -5,-3.75 -5,99.5
  pour Bottom (isolate 0.305): -7.75,103 96.5,103 96.5,-7 -9.25,-7 -9.5,-7.25 -9.5,103
GNDO  (via drill 0.35)
  Top 0.254: v23.47,79.09 26.64,79.09 U1.9 | ORN6.5 49.19,65.62 49.19,66.33 ORN6.6 49.19,66.44 49.19,67.15 ORN6.7 49.29,67.05 49.8,67.56 49.8,68.37 48.37,69.8 | 48.37,69.8 47.66,69.8 47.25,69.39 47.25,68.78 47.86,68.17 47.86,67.97 ORN6.1 | 48.37,69.8 48.47,69.8 49.9,71.23 49.9,76.95 49.29,77.56 ORN2.5 49.19,77.56 49.19,78.27 ORN2.6 49.09,78.48 49.09,79.09 ORN2.7 49.19,79.19 49.19,79.91 ORN2.8 49.19,80.01 51.74,82.56 51.74,85.72 50.01,87.46 42.86,87.46 39.59,90.72 38.88,90.72 EC6.- 38.78,90.72 33.68,90.72 33.47,90.52 OD2.A 33.37,90.42 32.96,90.01 v32.96,88.68
  Bottom 0.254: XO.2 5,87.56 13.47,79.09 v23.47,79.09 23.47,79.19 v32.96,88.68
GPA0
  Top 0.203: 17.3,34.44 18.37,35.51 18.37,36.33 IC1.21 | 17.3,34.44 16.63,33.78 10.92,33.78 IR1.8 | 17.3,34.44 22.04,29.7 23.68,29.7 OK1.16
GPA1
  Top 0.203: 22.5,28.42 23.68,27.25 OK1.14 | 22.5,28.42 18.06,32.86 10.92,32.86 IR1.7 | 22.5,28.42 23.06,28.98 24.29,28.98 24.59,29.29 24.59,30.11 24.39,30.31 22.04,30.31 19.08,33.27 19.08,36.33 IC1.22
GPA2  (via drill 0.35)
  Top 0.203: v13.47,32.15 10.92,32.15 IR1.6 | v19.08,37.76 19.7,37.15 19.7,36.43 IC1.23 | v19.59,29.8 20,29.39 20,28.37 23.68,24.7 OK1.12
  Bottom 0.203: v19.08,37.76 14.95,33.62 | 14.95,33.62 v13.47,32.15 | v19.59,29.8 18.78,29.8 14.95,33.62
GPA3  (via drill 0.35)
  Top 0.203: 17.81,31.18 18.88,30.11 18.88,29.49 19.59,28.78 19.59,26.23 23.68,22.14 OK1.10 | 17.81,31.18 17.76,31.23 10.92,31.23 IR1.5 | v20.31,33.68 20.31,36.33 IC1.24 | 17.81,31.18 v18.16,31.53
  Bottom 0.203: v18.16,31.53 v20.31,33.68
GPA4  (via drill 0.35)
  Top 0.203: v14.08,15.21 10.92,15.21 IR2.8 | v25.92,15.92 26.74,15.92 26.79,15.87 | 26.79,15.87 27.14,15.51 OK2.16 | 26.79,15.87 30.61,19.7 30.61,38.27 30.41,38.47 22.35,38.47 21.12,37.25 21.12,36.43 IC1.25
  Bottom 0.203: v14.08,15.21 15.41,15.21 16.12,15.92 v25.92,15.92
GPA5  (via drill 0.35)
  Top 0.203: v16.53,16.63 14.39,14.49 10.92,14.49 IR2.7 | v23.47,16.63 27.14,12.96 OK2.14 | v21.64,31.74 21.64,36.33 IC1.26
  Bottom 0.203: v23.47,16.63 21.64,16.63 | 21.64,16.63 v16.53,16.63 | 21.64,16.63 v21.64,31.74
GPA6  (via drill 0.35)
  Top 0.203: v11.94,13.57 10.92,13.57 IR2.6 | v24.39,8.16 26.53,10.31 27.14,10.31 OK2.12 | v22.35,33.47 22.35,36.33 IC1.27
  Bottom 0.203: v24.39,8.16 17.35,8.16 v11.94,13.57 12.04,13.57 12.04,14.8 20.31,23.06 20.31,31.43 v22.35,33.47
GPA7  (via drill 0.35)
  Top 0.203: v13.78,12.76 10.92,12.76 IR2.5 | v26.12,8.88 27.14,7.86 OK2.10 | v23.06,31.02 23.06,36.33 IC1.28
  Bottom 0.203: v13.78,12.76 13.98,12.76 17.86,8.88 v26.12,8.88 26.64,9.39 26.64,16.23 23.06,19.8 v23.06,31.02
GPB0
  Top 0.203: ORN4.8 24.39,46.84 24.39,45 23.06,43.68 IC1.1
GPB1
  Top 0.203: ORN4.7 23.57,46.84 23.57,45.62 22.35,44.39 22.35,43.68 IC1.2
GPB2
  Top 0.203: ORN4.6 22.76,46.84 22.76,45.51 21.74,44.49 21.74,43.68 IC1.3
GPB3
  Top 0.203: ORN4.5 22.04,46.84 22.04,45.41 21.12,44.49 21.12,43.68 IC1.4
GPB4
  Top 0.203: ORN1.8 18.98,46.84 18.98,45.82 20.31,44.49 20.31,43.68 IC1.5
GPB5
  Top 0.203: ORN1.7 18.16,46.84 18.16,45.92 19.7,44.39 19.7,43.68 IC1.6
GPB6
  Top 0.203: ORN1.6 17.45,46.84 17.45,46.02 18.98,44.49 18.98,43.68 IC1.7
GPB7
  Top 0.203: ORN1.5 16.63,46.84 16.63,46.23 18.37,44.49 18.37,43.68 IC1.8
IO5  (via drill 0.35)
  Top 0.203: v47.96,69.09 49.09,67.97 ORN6.8 | v43.98,69.09 43.58,69.09 43.06,69.6 OK4.15 42.96,69.7 40.72,71.94 35.1,71.94 34.09,70.92 29.39,70.92 27.66,72.66 26.74,72.66 U1.4
  Bottom 0.203: v43.98,69.09 v47.96,69.09
IO6
  Top 0.203: 42.3,66.38 42.96,67.05 OK4.13 | 42.3,66.38 42.15,66.23 42.15,62.97 42.35,62.76 43.68,62.76 43.88,62.97 43.88,63.37 47.66,67.15 47.86,67.15 ORN6.2 | 42.3,66.38 37.15,71.54 35.31,71.54 34.29,70.52 29.19,70.52 28.27,71.44 26.74,71.44 U1.3
IO7  (via drill 0.35)
  Top 0.203: v46.94,65.41 46.94,65.72 47.55,66.33 47.86,66.33 ORN6.3 | v44.09,65.41 43.88,65.41 43.06,64.6 OK4.11 | v40,65.11 38.68,66.44 35.72,66.44 32.55,63.27 31.12,63.27 30.82,63.58 30.82,64.8 30.41,65.21 28.68,65.21 25.31,68.58 25.31,69.29 26.12,70.11 26.64,70.11 U1.2
  Bottom 0.203: v46.94,65.41 v44.09,65.41 43.78,65.11 v40,65.11
IO8
  Top 0.203: ORN6.4 47.86,65.52 47.86,65.31 44.7,62.15 43.06,62.15 OK4.9 42.96,62.15 42.35,62.15 41.74,62.76 41.74,64.39 37.15,68.99 35.72,68.99 33.98,67.25 28.98,67.25 27.35,68.88 26.74,68.88 U1.1
LEDA
  Top 0.203: ER3.1 57.25,47.55 69.8,47.55 71.74,45.62 78.17,45.62 80.82,42.96 U$2.Y+
LEDB
  Top 0.203: ER4.1 57.25,45.31 59.09,47.15 64.7,47.15 79.8,32.04 79.8,30.72 80.82,29.7 U$2.G+
N$1
  Top 0.203: OD1.A 11.53,91.44 5,91.44 XO.1
N$2
  Top 0.203: PD1.C 65.82,4.29 65.82,8.47 PF1.1
N$3
  Top 0.203: MR3.1 10.31,39.59 11.33,39.59 14.49,36.43 IC1.15
N$4
  Top 0.203: OF1.2 21.33,90.52 16.94,90.52 16.02,91.44 OD1.C
N$5
  Top 0.203: R6.2 71.23,25.31 73.17,25.31 INDL.A
N$6
  Top 0.203: OF3.1 10,57.15 5,57.15 XO.10
N$7
  Top 0.203: D1.1 22.66,58.78 22.66,59.49 19.9,62.25 19.9,68.07 17.86,70.11 17.35,70.11 U1.17 17.96,70.11 18.68,70.82 18.68,71.84 18.47,72.05 16.12,72.05 15.1,71.03 13.27,71.03 11.74,69.5 11.74,63.68 12.86,62.56 12.86,61.03 OF2.2
N$8
  Top 0.203: ORN1.4 16.63,48.17 16.63,49.7 24.39,57.45 24.39,66.74 22.25,68.88 22.25,79.6 27.76,85.11 36.23,85.11 OK3.1
N$9
  Top 0.203: ER3.2 55.31,47.45 55.31,46.74 53.98,45.41 53.98,42.45 54.29,42.15 55.11,42.15 ENC.27
N$10
  Top 0.203: 71.54,69.41 71.54,69.39 71.63,69.32 | MC.8 70.31,71.64 70.31,71.44 71.54,70.21 71.54,69.75 71.54,69.41 | Q1.3 71.54,69.41
N$11
  Top 0.203: PR1.1 71.23,21.23 73.17,21.23 PL.A
N$12
  Top 0.203: OK1.15 23.78,28.47 24.39,28.47 28.78,32.86 28.78,36.53 29.7,37.45 IL1.A
N$13
  Top 0.203: ENC.1 47.96,42.76 47.96,45.11 49.8,46.94 EC3.+
N$14
  Top 0.203: ER4.2 55.41,45.31 55.41,46.13 56.13,46.84 56.13,48.17 55.82,48.47 52.05,48.47 51.33,47.76 51.33,44.39 54.29,41.43 55.11,41.43 ENC.26
N$15
  Top 0.203: MC.7 69.7,70.92 70.11,70.52 70.11,67.56 Q1.1 | MC.7
N$16  (via drill 0.35)
  Top 0.203: v52.35,11.94 50.41,10 50.01,10 PIC33.2 | PD2.C 51.33,23.68 52.35,22.66 v52.35,21.84 50.92,21.84 49.7,20.61 49.7,17.45 45.51,13.27 45.51,8.78 PCO.P$2
  Bottom 0.203: v52.35,21.84 v52.35,11.94
N$17
  Top 0.203: ER1.1 49.6,31.02 49.6,31.33 47.25,33.68 47.05,33.68 46.74,33.98 46.74,36.53 47.05,36.84 47.86,36.84 ENC.10
N$18
  Top 0.203: IIR1.1 9.59,28.47 9.59,30.31 7.25,32.66 7.25,35.31 XI1.2
N$19
  Top 0.203: ER10.1 51.33,31.02 51.13,31.02 47.96,34.19 ENC.14
N$20
  Top 0.203: OK1.13 23.78,25.92 29.7,31.84 29.7,33.68 IL2.A
N$21
  Top 0.203: OK1.11 23.78,23.37 29.7,29.29 29.7,29.9 IL3.A
N$22
  Top 0.203: ENC.24 55.21,40.11 55.92,40.11 56.43,39.59 57.25,39.59 EC2.1 57.35,39.59 57.35,41.74 59.09,43.47 Q2.1
N$23
  Top 0.203: OK1.9 23.78,20.82 24.59,20.82 29.7,25.92 IL4.A
N$24
  Top 0.203: 57.2,38.12 56.23,39.09 56.23,39.19 56.02,39.39 55.21,39.39 ENC.23 | 57.2,38.12 57.25,38.06 57.25,37.04 EC1.1 | 57.2,38.12 57.25,38.17 59.29,38.17 60.72,39.59 60.72,41.33 62.86,43.47 Q2.2
N$25
  Top 0.203: OK2.15 27.45,14.19 29.7,16.43 IL5.A
N$26
  Top 0.203: OK2.13 27.25,11.74 28.78,11.74 29.7,12.65 IL6.A
N$27
  Top 0.203: OK2.11 27.25,9.08 29.7,9.08 IL7.A
N$28
  Top 0.203: IIR1.2 9.59,27.66 9.39,27.66 7.25,29.8 7.25,31.43 5,33.68 XI1.3
N$29
  Top 0.203: IIR1.8 10.92,28.47 16.02,28.47 17.25,29.7 OK1.1
N$30
  Top 0.203: IIR1.7 10.92,27.55 16.94,27.55 17.25,27.25 OK1.3
N$31
  Top 0.203: IIR1.6 10.92,26.84 15.1,26.84 17.25,24.7 OK1.5
N$32
  Top 0.203: IIR1.5 10.92,26.02 13.37,26.02 17.25,22.14 OK1.7
N$33
  Top 0.203: IIR1.3 9.59,26.94 7.96,26.94 5,29.9 XI1.4
N$34
  Top 0.203: IIR1.4 9.59,26.12 XI1.5
N$35  (via drill 0.35)
  Top 0.203: v24.8,67.35 24.8,57.25 17.45,49.9 17.45,48.17 ORN1.3 | v35.21,82.05 35.72,82.05 36.23,82.56 OK3.3
  Bottom 0.203: v24.8,67.35 24.8,71.64 v35.21,82.05
N$36
  Top 0.203: IIR2.1 9.59,10 9.59,11.74 5,16.33 5,16.53 XI2.2
N$37  (via drill 0.35)
  Top 0.203: v13.78,13.78 14.49,13.06 14.49,12.45 12.04,10 10.92,10 IIR2.8 | v18.88,17.35 20.72,15.51 OK2.1
  Bottom 0.203: v13.78,13.78 13.78,14.49 13.37,14.9 13.37,15.51 15.21,17.35 v18.88,17.35
N$38
  Top 0.203: IIR2.2 9.59,9.18 8.47,9.18 5,12.65 XI2.3
N$39
  Top 0.203: IIR2.7 10.92,9.18 17.04,9.18 20.72,12.86 OK2.3
N$40
  Top 0.203: IIR2.3 9.59,8.37 5.51,8.37 5,8.88 XI2.4
N$41
  Top 0.203: IIR2.6 10.92,8.37 14.39,8.37 14.8,8.78 19.18,8.78 20.72,10.31 OK2.5
N$42
  Top 0.203: IIR2.4 9.59,7.45 7.25,7.45 5,5.21 XI2.5
N$43
  Top 0.203: IIR2.5 10.92,7.55 14.19,7.55 14.7,8.06 20.51,8.06 20.72,7.86 OK2.7
N$44
  Top 0.203: OK2.9 27.25,6.53 28.47,6.53 29.7,5.31 IL8.A
N$45  (via drill 0.35)
  Top 0.203: v28.27,60.11 18.16,50.01 18.16,48.17 ORN1.2 | v32.66,77.46 33.06,77.46 35.72,80.11 36.23,80.11 OK3.5
  Bottom 0.203: v28.27,60.11 28.27,69.19 32.66,73.58 v32.66,77.46
N$46  (via drill 0.35)
  Top 0.203: v28.27,59.09 18.98,49.8 18.98,48.17 ORN1.1 | v34.7,77.05 35.1,77.05 35.62,77.56 36.23,77.56 OK3.7
  Bottom 0.203: v28.27,59.09 28.98,59.8 28.98,69.29 34.7,75.01 v34.7,77.05
N$47
  Top 0.203: 19.95,58.63 18.88,57.56 13.27,57.56 12.96,57.25 OF3.2 | 19.95,58.63 20,58.68 20.72,58.68 D1.2 | 19.95,58.63 19.49,59.09 19.49,66.23 17.35,68.37 17.35,68.88 U1.18
N$48
  Top 0.203: ORN3.1 47.86,85.93 43.47,85.93 42.76,85.21 OK3.16
N$49
  Top 0.203: D2.2 16.74,58.78 16.74,60.92 12.96,64.7 OF4.2 12.96,64.8 14.08,65.92 14.08,68.68 16.84,71.44 17.25,71.44 U1.16
N$50  (via drill 0.35)
  Top 0.203: v18.68,61.43 18.68,58.78 D2.1 | v13.16,66.94 13.16,68.27 12.96,68.48 OF5.2 | v15.72,72.66 17.25,72.66 U1.15
  Bottom 0.203: v18.68,61.43 v13.16,66.94 13.27,66.94 15.72,69.39 v15.72,72.66
N$51
  Top 0.203: OF2.1 10,60.92 5,60.92 XO.9
N$52
  Top 0.203: OF4.1 10,64.8 5,64.8 XO.8
N$53
  Top 0.203: ORN3.2 47.86,85.11 45.82,85.11 43.37,82.66 42.76,82.66 OK3.14
N$54
  Top 0.203: OF5.1 10,68.48 5,68.48 XO.7
N$55
  Top 0.203: OF6.1 10,72.25 5,72.25 XO.6
N$56
  Top 0.203: ORN3.3 47.86,84.29 46.84,84.29 42.76,80.21 OK3.12
N$57
  Top 0.203: D3.1 22.76,64.5 22.76,61.33 23.98,60.11 23.98,57.66 22.25,55.92 12.04,55.92 11.33,56.64 11.33,74.39 12.86,75.92 OF7.2 12.96,75.92 13.57,75.31 17.25,75.31 U1.13
N$58
  Top 0.203: ORN3.4 47.86,83.48 47.86,82.76 42.76,77.66 OK3.10
N$59  (via drill 0.35)
  Top 0.203: v16.74,67.97 16.74,64.6 D4.2 | U1.12 17.25,76.54 16.74,76.03 v15.72,76.03 12.96,78.78 12.96,79.7 OF8.2
  Bottom 0.203: v16.74,67.97 16.74,75.01 v15.72,76.03
N$60
  Top 0.203: OK3.2 36.23,83.89 31.94,83.89 31.84,83.78 OL1.A
N$61
  Top 0.203: OK3.4 36.23,81.33 33.17,81.33 31.84,80.01 OL2.A
N$62
  Top 0.203: OK3.6 36.23,78.78 35,78.78 32.55,76.33 31.84,76.33 OL3.A
N$63
  Top 0.203: OK3.8 36.23,76.23 35.82,76.23 31.84,72.25 OL4.A
N$64  (via drill 0.35)
  Top 0.203: v18.78,65.92 18.78,64.6 D4.1 | v18.88,75.92 18.88,76.74 17.86,77.76 17.35,77.76 U1.11 17.25,77.86 16.84,77.86 16.02,78.68 16.02,78.78 12.96,81.84 12.96,83.48 OF9.2
  Bottom 0.203: v18.78,65.92 18.78,75.82 v18.88,75.92
N$65
  Top 0.203: D3.2 20.72,64.6 20.72,71.13 17.86,73.99 17.35,73.99 U1.14 17.25,73.99 16.02,73.99 14.29,72.25 12.96,72.25 OF6.2
N$66
  Top 0.203: OF7.1 10,76.03 5.1,76.03 5,76.13 XO.5
N$67
  Top 0.203: OF8.1 10,79.8 5.1,79.8 5,79.91 XO.4
N$68
  Top 0.203: OF9.1 10,83.58 5.1,83.58 5,83.68 XO.3
N$69  (via drill 0.35)
  Top 0.203: v22.14,51.33 22.14,48.17 ORN4.4 | v35.41,70.62 36.13,70.62 36.43,70.92 OK4.1
  Bottom 0.203: v22.14,51.33 22.14,63.68 31.94,73.48 31.94,77.76 32.35,78.17 34.59,78.17 35.41,77.35 v35.41,70.62
N$70  (via drill 0.35)
  Top 0.203: v25.61,55.05 22.85,52.29 ORN4.3 | v35.51,67.76 35.82,67.76 36.43,68.37 OK4.3
  Bottom 0.203: v25.61,55.05 29.39,58.83 29.39,61.64 v35.51,67.76
N$71
  Top 0.203: ORN4.2 23.68,48.17 23.68,51.94 30,58.27 30.41,58.27 30.82,58.68 30.82,60.92 35.72,65.82 36.43,65.82 OK4.5
N$72
  Top 0.203: ORN4.1 24.49,48.17 24.49,49.39 30.82,55.72 30.82,57.05 35.62,61.84 35.62,62.45 36.43,63.27 OK4.7
N$73
  Top 0.203: ORN5.1 47.86,73.88 45.92,73.88 43.06,71.03 OK4.16
N$74
  Top 0.203: ORN5.2 47.86,73.07 47.55,73.07 44.7,70.21 44.7,68.78 44.29,68.37 43.06,68.37 OK4.14
N$75
  Top 0.203: ORN5.3 47.86,72.25 47.55,72.25 45.11,69.8 45.11,67.97 43.06,65.92 OK4.12
N$76
  Top 0.203: ORN5.4 47.86,71.54 47.86,70.72 45.51,68.37 45.51,65.82 43.06,63.37 OK4.10
N$77
  Top 0.203: OK4.2 36.43,69.6 33.17,69.6 31.84,68.27 OL5.A
N$78
  Top 0.203: OK4.4 36.43,67.05 34.59,67.05 31.84,64.29 OL6.A
N$79
  Top 0.203: OK4.6 36.43,64.5 36.02,64.5 31.84,60.31 OL7.A
N$80
  Top 0.203: OK4.8 36.43,62.05 36.43,60.92 31.84,56.33 OL8.A
OI1
  Top 0.203: 41.48,84.65 42.15,83.99 42.66,83.99 OK3.15 | 41.48,84.65 41.43,84.7 41.43,85.72 42.66,86.95 49.8,86.95 51.23,85.52 51.23,83.07 48.17,80.01 47.96,80.01 ORN2.1 | 41.48,84.65 40.11,83.27 33.37,83.27 30.82,80.72 30.82,79.39 29.29,77.86 26.74,77.86 U1.8
OI2
  Top 0.203: 41.89,82.2 42.66,81.44 OK3.13 | 41.89,82.2 41.84,82.25 41.84,82.97 42.15,83.27 43.37,83.27 43.58,83.48 43.58,84.29 43.37,84.5 42.25,84.5 41.84,84.91 41.84,85.52 42.86,86.54 49.6,86.54 50.82,85.31 50.82,83.27 50.41,82.86 49.7,82.86 47.15,80.31 47.15,79.6 47.55,79.19 47.86,79.19 ORN2.2 | 41.89,82.2 40.51,80.82 35,80.82 31.64,77.46 29.19,77.46 28.37,76.64 26.74,76.64 U1.7
OI3
  Top 0.203: 41.89,77.2 41.84,77.25 41.84,77.97 42.66,78.78 OK3.11 | 41.89,77.2 42.15,76.95 43.37,76.95 44.7,78.27 47.86,78.27 ORN2.3 | 41.89,77.2 41.64,76.95 35.62,76.95 33.98,75.31 26.74,75.31 U1.6
OI4
  Top 0.203: ORN2.4 47.86,77.46 44.49,77.46 43.37,76.33 42.76,76.33 OK3.9 42.66,76.23 38.78,76.23 33.88,71.33 31.02,71.33 30.82,71.54 30.82,72.86 29.7,73.99 26.74,73.99 U1.5
RAW_IV
  Top 0.254: 40.51,25.92 40.51,34.8 GPIO.1 | 40.51,25.92 36.64,22.04 PC1.+ | 53.58,14.08 63.58,14.08 64.6,13.06 64.6,12.14 66.23,10.51 68.78,10.51 70.72,8.57 PF1.2 | 53.58,14.08 52.96,14.08 50.62,11.74 50.01,11.74 PIC33.1 | 40.51,25.92 52.66,25.92 53.58,25 53.58,14.08
RD+
  Top 0.203: 67.45,34.39 68.88,34.39 U$2.RD+ | 67.45,34.39 66.23,34.39 64.29,32.45 61.13,32.45 ERN1.6 | 67.45,34.39 67.45,32.76 64.7,30 59.6,30 59.19,30.41 55.01,30.41 53.88,31.53 53.88,31.74 53.68,31.94 53.58,31.94 50.62,34.9 47.96,34.9 ENC.13
RD-  (via drill 0.35)
  Top 0.203: v62.97,31.12 62.56,31.53 61.13,31.53 ERN1.5 | v53.58,32.96 51.02,35.51 47.96,35.51 ENC.12
  Bottom 0.203: U$2.RD- 66.44,38.17 66.54,38.06 69.29,38.06 70.01,37.35 70.01,31.53 69.29,30.82 68.58,30.82 68.27,31.12 v62.97,31.12 57.96,31.12 56.13,32.96 v53.58,32.96
RESET  (via drill 0.35)
  Top 0.203: 56.64,81.23 58.07,81.23 C2.1 58.17,81.33 58.17,81.84 63.78,87.46 66.23,87.46 67.45,88.68 68.48,88.68 BL.5 68.58,88.78 68.68,88.89 80.93,88.89 83.07,86.74 83.07,25.51 81.54,23.98 81.54,21.02 SR.1 | 56.64,81.23 55.92,81.23 R2.1 | v62.97,72.05 62.97,70.11 62.56,69.7 62.56,69.5 MC.29 | 56.64,81.23 v56.64,76.74
  Bottom 0.203: v62.97,72.05 62.97,74.39 60.82,76.54 56.84,76.54 v56.64,76.74
RXI  (via drill 0.35)
  Top 0.203: v65.11,69.29 63.78,69.29 63.37,68.88 63.07,68.88 MC.30 | v67.52,53.58 67.52,50.83 70.91,47.44 PP.4
  Bottom 0.203: v65.11,69.29 65.11,68.88 68.27,65.72 68.27,54.33 v67.52,53.58
TD+  (via drill 0.35)
  Top 0.203: v57.45,32.66 58.68,33.88 59.8,33.88 ERN1.1 | v57.25,34.19 55.92,35.51 55.21,35.51 ENC.17
  Bottom 0.203: U$2.TD+ 68.88,31.84 62.66,31.84 62.56,31.74 58.58,31.74 57.66,32.66 v57.45,32.66 57.25,32.86 v57.25,34.19
TD-
  Top 0.203: 58.02,32.2 57.15,31.33 55.82,31.33 55.62,31.53 55.62,33.37 56.23,33.98 56.23,34.59 55.92,34.9 55.21,34.9 ENC.16 | 58.02,32.2 58.17,32.35 58.17,32.76 58.58,33.17 59.8,33.17 ERN1.2 | 58.02,32.2 59.8,30.41 63.27,30.41 65.92,33.06 66.33,33.06 U$2.TD-
TXO
  Top 0.203: PP.3 72.25,50.15 66.86,55.55 62.83,55.55 59.39,58.98 59.39,64.09 63.58,68.27 MC.31
VDDO  (via drill 0.35)
  Top 0.254: ORN5.5 49.19,71.64 49.19,72.25 ORN5.6 49.19,72.46 49.19,73.07 ORN5.7 49.09,73.27 49.09,73.88 ORN5.8 49.19,73.99 v49.19,76.64 | ORN3.8 49.19,85.93 49.19,85.21 ORN3.7 49.19,85.11 49.19,84.39 ORN3.6 49.19,84.29 49.19,83.58 ORN3.5 49.29,83.58 v50.11,83.58 | D2.3 21.74,56.74 D1.3 21.84,56.84 22.25,56.84 23.47,58.07 23.47,59.9 21.74,61.64 21.74,62.35 D3.3 | v18.78,62.45 17.76,62.45 D4.3 | v20.72,62.45 21.74,62.45 D3.3 | D3.3 21.64,62.56 21.64,75.31 17.86,79.09 17.45,79.09 U1.10 17.35,79.09 17.35,79.6 24.08,86.33 24.08,90.42 OF1.1 24.19,90.52 28.98,90.52 OD2.C 29.08,90.62 30.51,92.05 39.7,92.05 40.92,90.83 41.64,90.83 EC6.+ 41.74,90.83 v42.96,89.6
  Bottom 0.254: v49.19,76.64 49.19,82.66 49.55,83.02 | v50.11,83.58 49.55,83.02 | v20.72,62.45 v18.78,62.45 | v42.96,89.6 49.55,83.02
VIN
  Top 0.203: PJ1.VIN0 81.95,4.39 80.52,5.82 74.29,5.82 72.76,4.29 70.21,4.29 PD1.A 70.11,4.18 67.35,1.43 5.92,1.43 2.25,5.1 2.25,41.43 4.9,44.09 4.9,47.25 XV.2
WFGPIO0
  Bottom 0.203: WIFI.GPIO0 67.25,64.29 67.25,63.27 65.72,61.74 65.72,61.43 54.49,50.21 40.62,50.21 GPIO.13
WFGPIO2
  Bottom 0.203: WIFI.GPIO2 64.7,64.29 63.88,64.29 62.45,62.86 50.72,62.86 38.06,50.21 GPIO.14

## Text on the board
tPlace: Edge | IOTECH © 2019 | IOTB v2.2 TOP | www.iotech.com.tr | S/N:
bPlace: IOTECH | IOTB BOT